# Altium schematic sheet Side2.SchDoc
size Letter
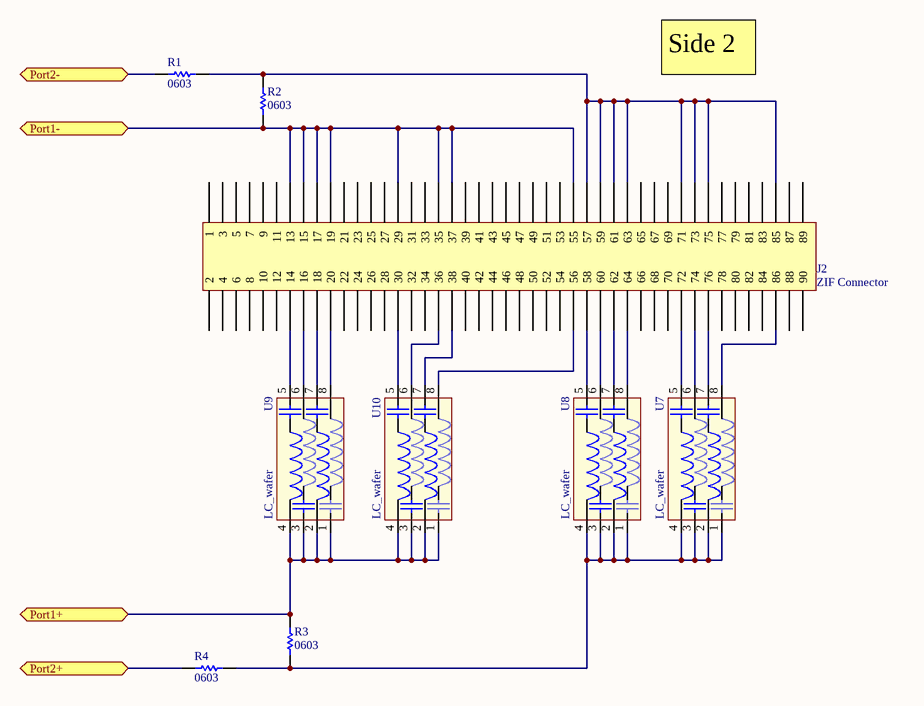
[diagram p0: Side2.SchDoc]

## Parts
J2  ZIF Connector  [LCBoard_ZIFCon]
R1  0603  [0603]
R2  0603  [0603]
R3  0603  [0603]
R4  0603  [0603]
U7  LC_wafer  [LCWafer]
U8  LC_wafer  [LCWafer]
U9  LC_wafer  [LCWafer]
U10  LC_wafer  [LCWafer]

## Ports
Port1+, Port1-, Port2+, Port2-

## Nets
Port1+: R3.2 U9.1 U9.2 U9.3 U9.4 U10.1 U10.2 U10.3 U10.4 ; port Port1+
Port1-: J2.13 J2.15 J2.17 J2.19 J2.29 J2.35 J2.37 J2.55 R2.1 ; port Port1-
Port2+: R4.2 ; port Port2+
Port2-: R1.2 ; port Port2-
NetJ2_14: J2.14 U9.5
NetJ2_16: J2.16 U9.6
NetJ2_18: J2.18 U9.7
NetJ2_20: J2.20 U9.8
NetJ2_30: J2.30 U10.5
NetJ2_36: J2.36 U10.6
NetJ2_38: J2.38 U10.7
NetJ2_56: J2.56 U10.8
NetJ2_57: J2.57 J2.59 J2.61 J2.63 J2.71 J2.73 J2.75 J2.85 R1.1 R2.2
NetJ2_58: J2.58 U8.5
NetJ2_60: J2.60 U8.6
NetJ2_62: J2.62 U8.7
NetJ2_64: J2.64 U8.8
NetJ2_72: J2.72 U7.5
NetJ2_74: J2.74 U7.6
NetJ2_76: J2.76 U7.7
NetJ2_86: J2.86 U7.8
NetR3_1: R3.1 R4.1 U7.1 U7.2 U7.3 U7.4 U8.1 U8.2 U8.3 U8.4

Not connected (* = marked no-connect by the designer): J2 1 2 3 4 5 6 7 8 9 10 11 12 21 22 23 24 25 26 27 28 31 32 33 34 39 40 41 42 43 44 45 46 47 48 49 50 51 52 53 54 65 66 67 68 69 70 77 78 79 80 81 82 83 84 87 88 89 90

## Notes on the sheet
- Side 2

## Library data of the parts
J2 = LCboard_FH16-90S-0.3SHW(05)
R1-R4 = Res0603: RES 1 OHM 1/10W 1% 0603 SMD; Value: 1; TechInfo: *
U7-U10 = LCWafer: Gold bonded integrated LC